# Altium schematic sheet 02_READ_ME.SchDoc: =project_title
size Tabloid; CompanyName: Luxonis Holding; Organization: Luxonis Holding; Address1: 1925 Harmony Park Drive; Address2: Westminster, CO; Address3: 80234; Address4: United States; SheetNumber: 1; SheetTotal: 3
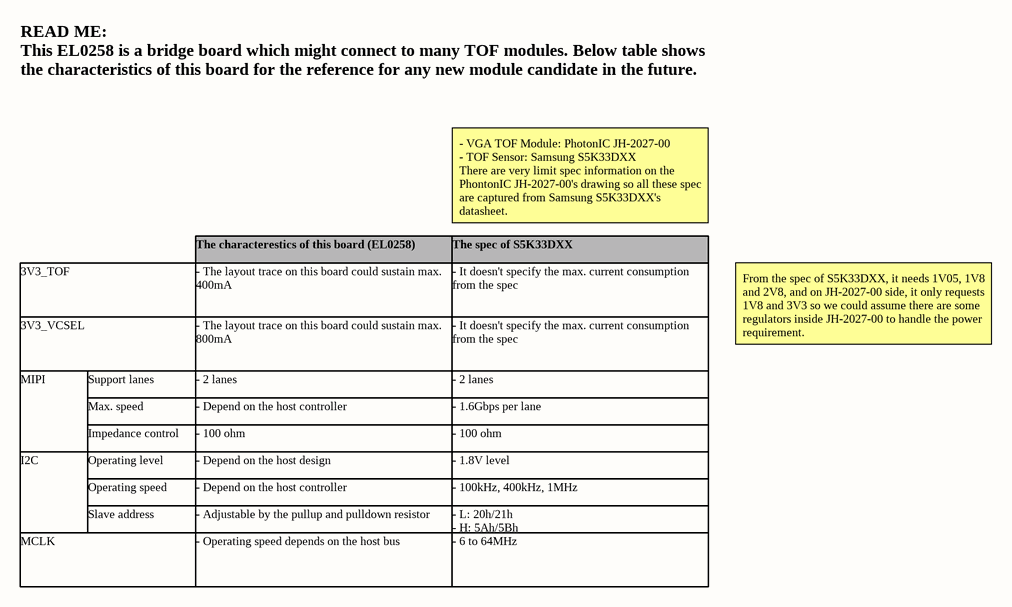
[diagram p0: 02_READ_ME.SchDoc]

## Notes on the sheet
- READ ME:
  This EL0258 is a bridge board which might connect to many TOF modules. Below table shows the characteristics of this board for the reference for any new module candidate in the future.
- - VGA TOF Module: PhotonIC JH-2027-00
  - TOF Sensor: Samsung S5K33DXX
  There are very limit spec information on the PhontonIC JH-2027-00's drawing so all these spec are captured from Samsung S5K33DXX's datasheet.
- 3V3_TOF
- - The layout trace on this board could sustain max. 400mA
- The characterestics of this board (EL0258)
- The spec of S5K33DXX
- - It doesn't specify the max. current consumption from the spec
- 3V3_VCSEL
- - The layout trace on this board could sustain max. 800mA
- From the spec of S5K33DXX, it needs 1V05, 1V8 and 2V8, and on JH-2027-00 side, it only requests 1V8 and 3V3 so we could assume there are some regulators inside JH-2027-00 to handle the power requirement.
- MIPI
- Support lanes
- Max. speed
- Impedance control
- - 2 lanes
- - Depend on the host controller
- - 100 ohm
- - 1.6Gbps per lane
- Operating level
- Operating speed
- - Depend on the host design
- - 1.8V level
- - 100kHz, 400kHz, 1MHz
- I2C
- MCLK
- Slave address
- - Adjustable by the pullup and pulldown resistor
- - Operating speed depends on the host bus
- - L: 20h/21h
  - H: 5Ah/5Bh
- - 6 to 64MHz
- Title
- Size:
- Date:
- Tabloid
- Number:
- Time:
- Revision:
- Sheet
- of
- Drawn by: